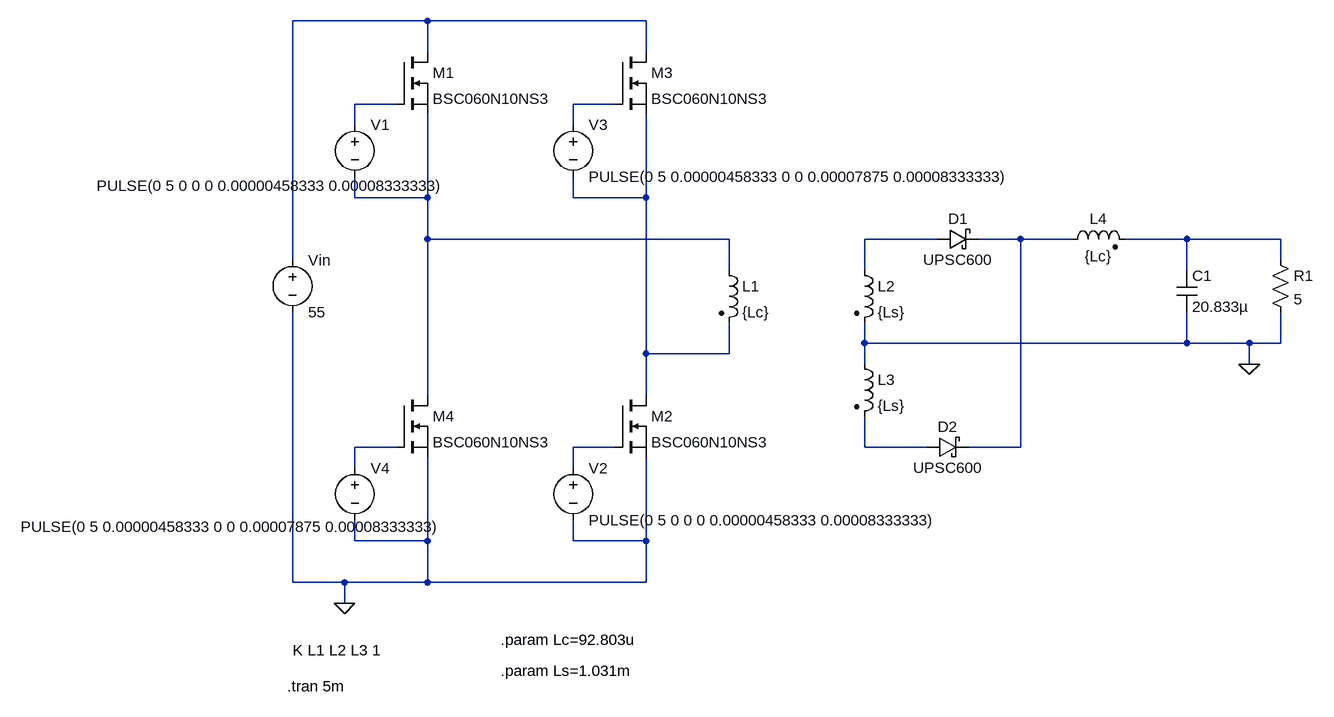
[diagram p0: schematic fullbridge_circuit.asc]
fullbridge_circuit.asc, the LTspice schematic file:
Version 4
SHEET 1 1200 680
WIRE -176 -480 -384 -480
WIRE 160 -480 -176 -480
WIRE -176 -432 -176 -480
WIRE 160 -432 160 -480
WIRE -224 -352 -288 -352
WIRE 112 -352 48 -352
WIRE -288 -320 -288 -352
WIRE 48 -320 48 -352
WIRE -288 -208 -288 -240
WIRE -176 -208 -176 -336
WIRE -176 -208 -288 -208
WIRE 48 -208 48 -240
WIRE 160 -208 160 -336
WIRE 160 -208 48 -208
WIRE -176 -144 -176 -208
WIRE 288 -144 -176 -144
WIRE 608 -144 496 -144
WIRE 736 -144 672 -144
WIRE 816 -144 736 -144
WIRE 992 -144 896 -144
WIRE 1136 -144 992 -144
WIRE -384 -112 -384 -480
WIRE 1136 -112 1136 -144
WIRE 288 -96 288 -144
WIRE 496 -96 496 -144
WIRE 992 -96 992 -144
WIRE 496 16 496 -16
WIRE 992 16 992 -32
WIRE 992 16 496 16
WIRE 1088 16 992 16
WIRE 1136 16 1136 -32
WIRE 1136 16 1088 16
WIRE 160 32 160 -208
WIRE 288 32 288 -16
WIRE 288 32 160 32
WIRE 496 48 496 16
WIRE 1088 48 1088 16
WIRE -176 96 -176 -144
WIRE 160 96 160 32
WIRE -224 176 -288 176
WIRE 112 176 48 176
WIRE 496 176 496 128
WIRE 592 176 496 176
WIRE 736 176 736 -144
WIRE 736 176 656 176
WIRE -288 208 -288 176
WIRE 48 208 48 176
WIRE -288 320 -288 288
WIRE -176 320 -176 192
WIRE -176 320 -288 320
WIRE 48 320 48 288
WIRE 160 320 160 192
WIRE 160 320 48 320
WIRE -384 384 -384 -32
WIRE -304 384 -384 384
WIRE -176 384 -176 320
WIRE -176 384 -304 384
WIRE 160 384 160 320
WIRE 160 384 -176 384
WIRE -304 416 -304 384
FLAG 1088 48 0
FLAG -304 416 0
SYMBOL voltage -384 -128 R0
WINDOW 123 0 0 Left 0
WINDOW 39 0 0 Left 0
SYMATTR InstName Vin
SYMATTR Value 55
SYMBOL res 1120 -128 R0
SYMATTR InstName R1
SYMATTR Value 5
SYMBOL voltage -288 -336 R0
WINDOW 123 0 0 Left 0
WINDOW 39 0 0 Left 0
WINDOW 3 -397 110 Left 2
SYMATTR Value PULSE(0 5 0 0 0 0.00000458333 0.00008333333)
SYMATTR InstName V1
SYMBOL schottky 608 -128 R270
WINDOW 0 32 32 VTop 2
WINDOW 3 0 32 VBottom 2
SYMATTR InstName D1
SYMATTR Value UPSC600
SYMATTR Description Diode
SYMATTR Type diode
SYMBOL nmos -224 -432 R0
SYMATTR InstName M1
SYMATTR Value BSC060N10NS3
SYMBOL ind2 272 -112 R0
SYMATTR InstName L1
SYMATTR Value {Lc}
SYMATTR Type ind
SYMBOL cap 976 -96 R0
SYMATTR InstName C1
SYMATTR Value 20.833µ
SYMBOL schottky 592 192 R270
WINDOW 0 32 32 VTop 2
WINDOW 3 0 32 VBottom 2
SYMATTR InstName D2
SYMATTR Value UPSC600
SYMATTR Description Diode
SYMATTR Type diode
SYMBOL voltage 48 -336 R0
WINDOW 123 0 0 Left 0
WINDOW 39 0 0 Left 0
SYMATTR InstName V3
SYMATTR Value PULSE(0 5 0.00000458333 0 0 0.00007875 0.00008333333)
SYMBOL nmos 112 -432 R0
SYMATTR InstName M3
SYMATTR Value BSC060N10NS3
SYMBOL ind2 800 -128 R270
WINDOW 0 32 56 VTop 2
WINDOW 3 5 56 VBottom 2
SYMATTR InstName L4
SYMATTR Value {Lc}
SYMATTR Type ind
SYMBOL ind2 480 -112 R0
SYMATTR InstName L2
SYMATTR Value {Ls}
SYMATTR Type ind
SYMBOL ind2 480 32 R0
SYMATTR InstName L3
SYMATTR Value {Ls}
SYMATTR Type ind
SYMBOL voltage 48 192 R0
WINDOW 123 0 0 Left 0
WINDOW 39 0 0 Left 0
SYMATTR InstName V2
SYMATTR Value PULSE(0 5 0 0 0 0.00000458333 0.00008333333)
SYMBOL nmos 112 96 R0
SYMATTR InstName M2
SYMATTR Value BSC060N10NS3
SYMBOL voltage -288 192 R0
WINDOW 123 0 0 Left 0
WINDOW 39 0 0 Left 0
WINDOW 3 -514 106 Left 2
SYMATTR Value PULSE(0 5 0.00000458333 0 0 0.00007875 0.00008333333)
SYMATTR InstName V4
SYMBOL nmos -224 96 R0
SYMATTR InstName M4
SYMATTR Value BSC060N10NS3
TEXT -392 544 Left 2 !.tran 5m
TEXT -384 488 Left 2 !K L1 L2 L3 1
TEXT -64 472 Left 2 !.param Lc=92.803u
TEXT -64 520 Left 2 !.param Ls=1.031m

The netlist it stands for:
* fullbridge_circuit.asc
Vin N001 0 55
R1 N008 0 5
V1 N002 N004 PULSE(0 5 0 0 0 0.00000458333 0.00008333333)
D1 N006 N007 UPSC600
M1 N001 N002 N004 N004 BSC060N10NS3
L1 N004 N005 {Lc}
C1 N008 0 20.833µ
D2 N011 N007 UPSC600
V3 N003 N005 PULSE(0 5 0.00000458333 0 0 0.00007875 0.00008333333)
M3 N001 N003 N005 N005 BSC060N10NS3
L4 N007 N008 {Lc}
L2 N006 0 {Ls}
L3 0 N011 {Ls}
V2 N010 0 PULSE(0 5 0 0 0 0.00000458333 0.00008333333)
M2 N005 N010 0 0 BSC060N10NS3
V4 N009 0 PULSE(0 5 0.00000458333 0 0 0.00007875 0.00008333333)
M4 N004 N009 0 0 BSC060N10NS3
.model D D
.lib standard.dio
.model NMOS NMOS
.model PMOS PMOS
.lib standard.mos
.tran 5m
K L1 L2 L3 1
.param Lc=92.803u
.param Ls=1.031m
.backanno
.end